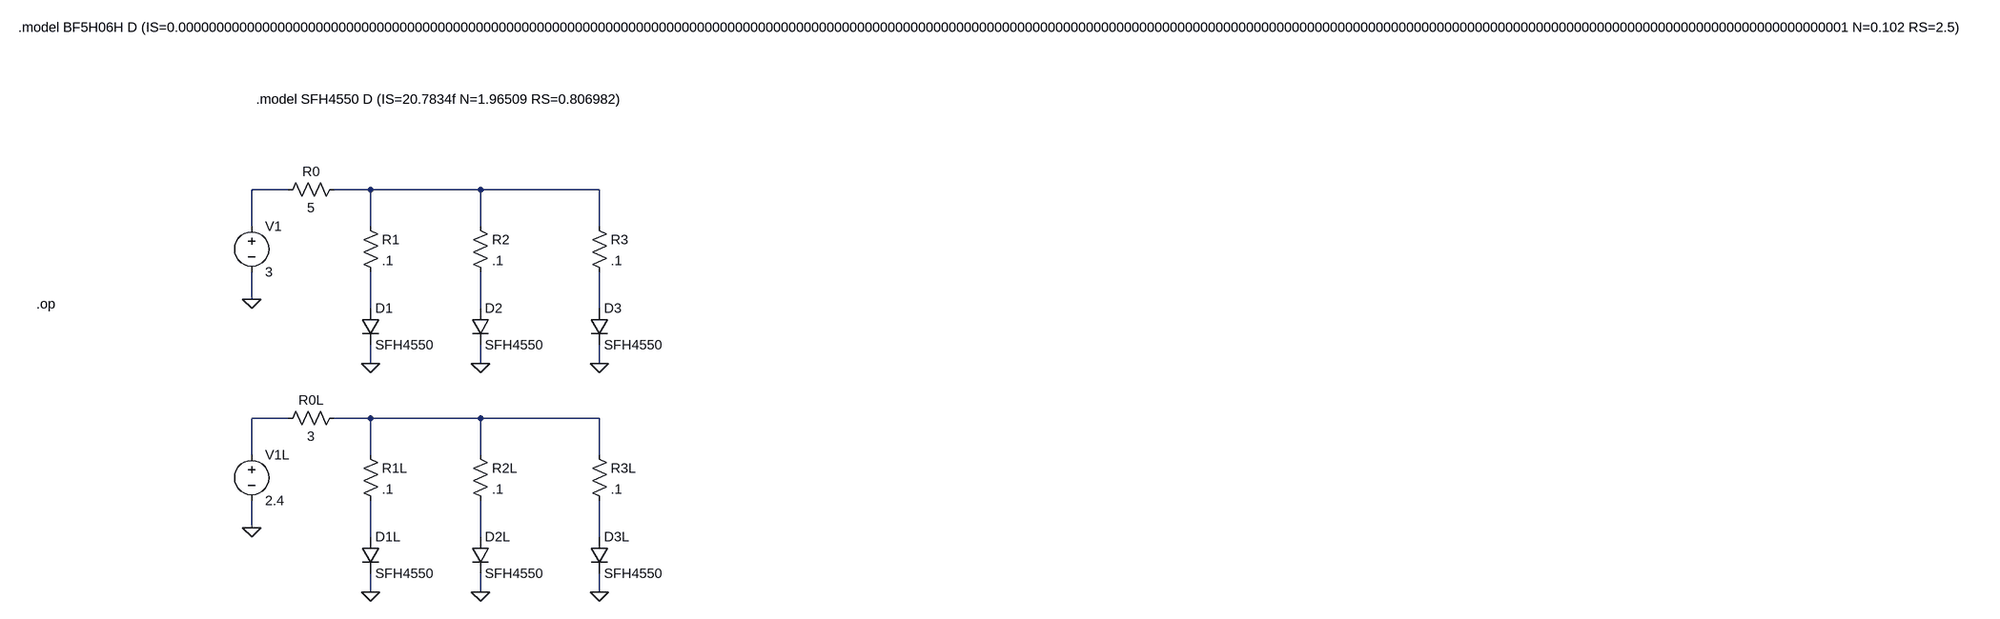
[diagram p0: schematic IR_Headset_LTSpice.asc]
IR_Headset_LTSpice.asc, the LTspice schematic file:
Version 4.1
SHEET 1 3616 680
WIRE 368 -368 304 -368
WIRE 512 -368 448 -368
WIRE 704 -368 512 -368
WIRE 912 -368 704 -368
WIRE 304 -304 304 -368
WIRE 512 -304 512 -368
WIRE 704 -304 704 -368
WIRE 912 -304 912 -368
WIRE 304 -176 304 -224
WIRE 512 -160 512 -224
WIRE 704 -160 704 -224
WIRE 912 -160 912 -224
WIRE 512 -64 512 -96
WIRE 704 -64 704 -96
WIRE 912 -64 912 -96
WIRE 368 32 304 32
WIRE 512 32 448 32
WIRE 704 32 512 32
WIRE 912 32 704 32
WIRE 304 96 304 32
WIRE 512 96 512 32
WIRE 704 96 704 32
WIRE 912 96 912 32
WIRE 304 224 304 176
WIRE 512 240 512 176
WIRE 704 240 704 176
WIRE 912 240 912 176
WIRE 512 336 512 304
WIRE 704 336 704 304
WIRE 912 336 912 304
FLAG 304 -176 0
FLAG 512 -64 0
FLAG 704 -64 0
FLAG 912 -64 0
FLAG 304 224 0
FLAG 512 336 0
FLAG 704 336 0
FLAG 912 336 0
SYMBOL diode 496 -160 R0
SYMATTR InstName D1
SYMATTR Value SFH4550
SYMBOL voltage 304 -320 R0
WINDOW 123 0 0 Left 0
WINDOW 39 0 0 Left 0
SYMATTR InstName V1
SYMATTR Value 3
SYMBOL res 464 -384 R90
WINDOW 0 0 56 VBottom 2
WINDOW 3 32 56 VTop 2
SYMATTR InstName R0
SYMATTR Value 5
SYMBOL res 496 -320 R0
SYMATTR InstName R1
SYMATTR Value .1
SYMBOL diode 688 -160 R0
SYMATTR InstName D2
SYMATTR Value SFH4550
SYMBOL res 688 -320 R0
SYMATTR InstName R2
SYMATTR Value .1
SYMBOL diode 896 -160 R0
SYMATTR InstName D3
SYMATTR Value SFH4550
SYMBOL res 896 -320 R0
SYMATTR InstName R3
SYMATTR Value .1
SYMBOL diode 496 240 R0
SYMATTR InstName D1L
SYMATTR Value SFH4550
SYMBOL voltage 304 80 R0
WINDOW 123 0 0 Left 0
WINDOW 39 0 0 Left 0
SYMATTR InstName V1L
SYMATTR Value 2.4
SYMBOL res 464 16 R90
WINDOW 0 0 56 VBottom 2
WINDOW 3 32 56 VTop 2
SYMATTR InstName R0L
SYMATTR Value 3
SYMBOL res 496 80 R0
SYMATTR InstName R1L
SYMATTR Value .1
SYMBOL diode 688 240 R0
SYMATTR InstName D2L
SYMATTR Value SFH4550
SYMBOL res 688 80 R0
SYMATTR InstName R2L
SYMATTR Value .1
SYMBOL diode 896 240 R0
SYMATTR InstName D3L
SYMATTR Value SFH4550
SYMBOL res 896 80 R0
SYMATTR InstName R3L
SYMATTR Value .1
TEXT 312 -576 Left 2 !.model SFH4550 D (IS=20.7834f N=1.96509 RS=0.806982)
TEXT -72 -168 Left 2 !.op
TEXT -104 -704 Left 2 !.model BF5H06H D (IS=0.000000000000000000000000000000000000000000000000000000000000000000000000000000000000000000000000000000000000000000000000000000000000000000000000000000000000000000000000000000000000000000000000000000000000000000000000001 N=0.102 RS=2.5)

The netlist it stands for:
* IR_Headset_LTSpice.asc
D1 N003 0 SFH4550
V1 N001 0 3
R0 N002 N001 5
R1 N002 N003 .1
D2 N004 0 SFH4550
R2 N002 N004 .1
D3 N005 0 SFH4550
R3 N002 N005 .1
D1L N008 0 SFH4550
V1L N006 0 2.4
R0L N007 N006 3
R1L N007 N008 .1
D2L N009 0 SFH4550
R2L N007 N009 .1
D3L N010 0 SFH4550
R3L N007 N010 .1
.model D D
.lib standard.dio
.model SFH4550 D (IS=20.7834f N=1.96509 RS=0.806982)
.op
.model BF5H06H D (IS=0.000000000000000000000000000000000000000000000000000000000000000000000000000000000000000000000000000000000000000000000000000000000000000000000000000000000000000000000000000000000000000000000000000000000000000000000000001 N=0.102 RS=2.5)
.backanno
.end